# EAGLE design PSX-PS2 (EAGLE 9.6.2)
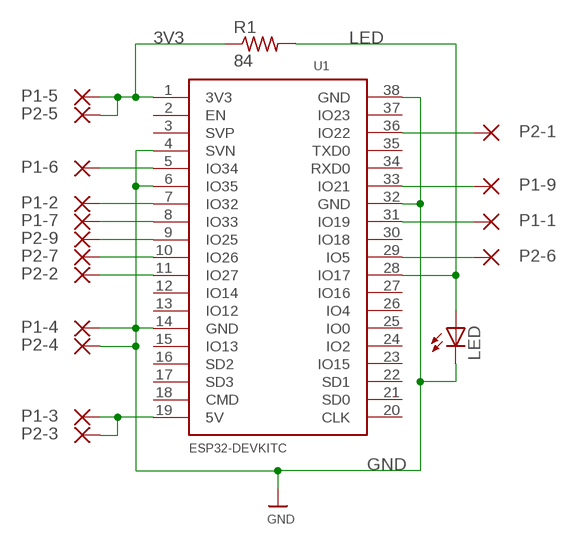
[diagram p0: schematic, sheet 1]

## Parts
LED  LEDCHIPLED_1206  [CHIPLED_1206]
P1-1  SMD5  [SMD2,54-5,08]
P1-2  SMD5  [SMD2,54-5,08]
P1-3  SMD5  [SMD2,54-5,08]
P1-4  SMD5  [SMD2,54-5,08]
P1-5  SMD5  [SMD2,54-5,08]
P1-6  SMD5  [SMD2,54-5,08]
P1-7  SMD5  [SMD2,54-5,08]
P1-9  SMD5  [SMD2,54-5,08]
P2-1  SMD5  [SMD2,54-5,08]
P2-2  SMD5  [SMD2,54-5,08]
P2-3  SMD5  [SMD2,54-5,08]
P2-4  SMD5  [SMD2,54-5,08]
P2-5  SMD5  [SMD2,54-5,08]
P2-6  SMD5  [SMD2,54-5,08]
P2-7  SMD5  [SMD2,54-5,08]
P2-9  SMD5  [SMD2,54-5,08]
R1  84  R-US_R1206  [R1206]
U1  ESP32DEVKITC  [ESP32-DEVKITC]

## Nets
3V3: P1-5.1(P) P2-5.1(P) R1.1 U1.1(3V3)
8V: P1-3.1(P) P2-3.1(P) U1.19(5V)
GND: LED.C P1-4.1(P) P2-4.1(P) U1.4(SVN) U1.6(IO35) U1.14(GND) U1.32(GND) U1.38(GND)
LED: LED.A R1.2 U1.28(IO17)
P1-1: P1-1.1(P) U1.31(IO19)
P1-2: P1-2.1(P) U1.7(IO32)
P1-6: P1-6.1(P) U1.5(IO34)
P1-7: P1-7.1(P) U1.8(IO33)
P1-9: P1-9.1(P) U1.33(IO21)
P2-1: P2-1.1(P) U1.36(IO22)
P2-2: P2-2.1(P) U1.11(IO27)
P2-6: P2-6.1(P) U1.29(IO5)
P2-7: P2-7.1(P) U1.10(IO26)
P2-9: P2-9.1(P) U1.9(IO25)
Unconnected: U1.2(EN) U1.3(SVP) U1.12(IO14) U1.13(IO12) U1.15(IO13) U1.16(SD2) U1.17(SD3) U1.18(CMD) U1.20(CLK) U1.21(SD0) U1.22(SD1) U1.23(IO15) U1.24(IO2) U1.25(IO0) U1.26(IO4) U1.27(IO16) U1.30(IO18) U1.34(RXD0) U1.35(TXD0) U1.37(IO23)

## Library data of the parts
LED = adafruit:LED: LED OSRAM: - CHIPLED LG R971, LG N971, LY N971, LG Q971, LY Q971, LO R971, LY R971 LH N974, LH R974 LS Q976, LO Q976, LY Q976 LO Q996 - Hyper CHIPLED LW Q18S LB Q993, LB Q99A, LB R99A - SideLED LS A670, LO A670, LY A670, LG A670, LP A670 LB A673, LV A673, LT A673, LW A673 LH A674 LY A675 LS A676, LA A676, LO A676, LY A676, LW A676 LS A679, LY A679, LG A679 - Hyper Micro SIDELED® LS Y876, LA Y876, LO Y876, LY Y876 LT Y87S - SmartLED LW L88C, LW L88S LB L89C, LB L89S, LG L890 LS L89K, LO L89K, LY L89K LS L896, LA L896, LO L896, LY L896 - TOPLED LS T670, LO T670, LY T670, LG T670, LP T670 LSG T670, LSP T670, LSY T670, LOP T670, LYG T670 LG T671, LOG T671, LSG T671 LB T673, LV T673, LT T673, LW T673 LH T674 LS T676, LA T676, LO T676, LY T676, LB T676, LH T676, LSB T676, LW T676 LB T67C, LV T67C, LT T67C, LS T67K, LO T67K, LY T67K, LW E67C LS E67B, LA E67B, LO E67B, LY E67B, LB E67C, LV E67C, LT E67C LW T67C LS T679, LY T679, LG T679 LS T770, LO T770, LY T770, LG T770, LP T770 LB T773, LV T773, LT T773, LW T773 LH T774 LS E675, LA E675, LY E675, LS T675 LS T776, LA T776, LO T776, LY T776, LB T776 LHGB T686 LT T68C, LB T68C - Hyper Mini TOPLED® LB M676 - Mini TOPLED Santana® LG M470 LS M47K, LO M47K, LY M47K Source: http://www.osram.convergy.de/
P1-1-P1-7 P1-9 P2-1-P2-7 P2-9 = wirepad:SMD5: SMD PAD
R1 = adafruit:R-US_: RESISTOR, American symbol
U1 = ESP32-DEVKITC4:ESP32DEVKITC

## Board
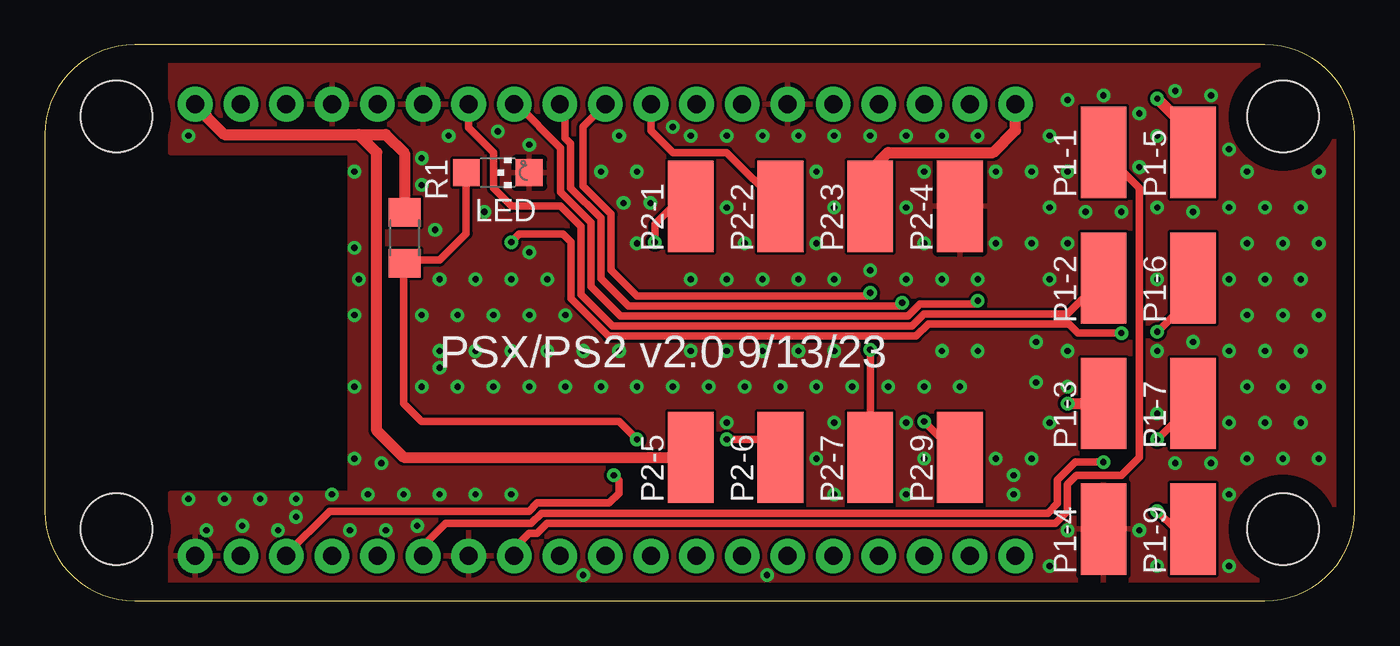
[diagram p1: board, top side]
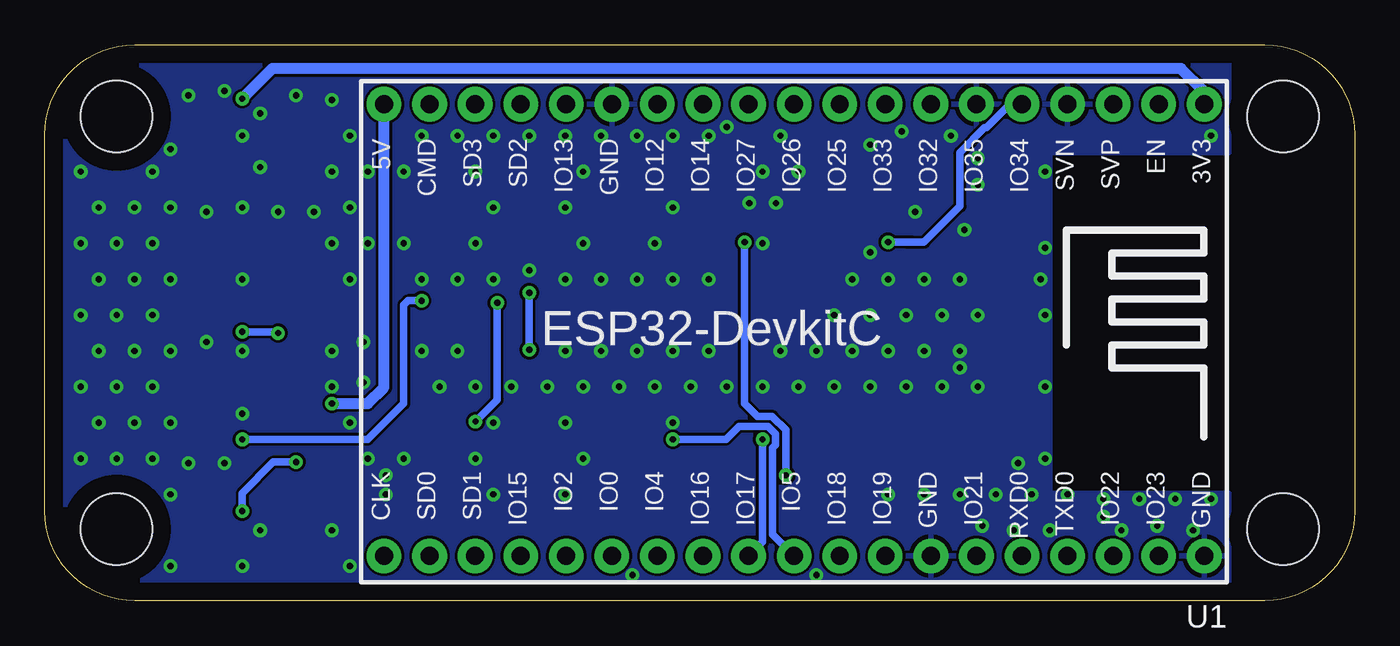
[diagram p2: board, bottom side, seen from below]

Size 73 x 31 mm. Coordinates in mm from the lower left corner, seen from the top.
Outline: 0,26 0,5 arc90 5,0 68,0 arc90 73,5 73,26 arc90 68,31 5,31 arc90 0,26
Copper layers (1*16): Top 0.035mm / dielectric 1.5mm / Bottom 0.035mm
Design rules "default": minimum track width 6mil, minimum drill 0.35mm, track to track 6mil, track to pad 6mil, pad to pad 6mil, via to via 6mil, smd to smd 6mil, copper to edge 40mil, drill to drill 6mil, minimum pad ring 10mil, minimum via ring 8mil, stop-mask expansion 4mil, vias tented up to drill 0.5mm, thermal gap 10mil
Holes 4 mm at 4,4 4,27 69,27 69,4

### Footprints (pad centres in the part's own frame; a part is rotated, then mirrored left to right if it is on the bottom)
CHIPLED_1206 = smd 1.5 x 1.5: A 0,-1.75; C 0,1.75
SMD2,54-5,08 = smd 2.54 x 5.08: 1 0,0
R1206 = smd 1.6 x 1.803: 1 -1.422,0; 2 1.422,0
ESP32-DEVKITC = drill 1 pad 1.93: 1 -22.87,-12.69; 2 -20.33,-12.69; 3 -17.79,-12.69; 4 -15.25,-12.69; 5 -12.71,-12.69; 6 -10.17,-12.69; 7 -7.63,-12.69; 8 -5.09,-12.69; 9 -2.55,-12.69; 10 -0.01,-12.69; 11 2.53,-12.69; 12 5.07,-12.69; 13 7.61,-12.69; 14 10.15,-12.69; 15 12.69,-12.69; 16 15.23,-12.69; 17 17.77,-12.69; 18 20.31,-12.69; 19 22.85,-12.69; 20 22.85,12.5; 21 20.31,12.5; 22 17.77,12.5; 23 15.23,12.5; 24 12.69,12.5; 25 10.15,12.5; 26 7.61,12.5; 27 5.07,12.5; 28 2.53,12.5; 29 -0.01,12.5; 30 -2.55,12.5; 31 -5.09,12.5; 32 -7.63,12.5; 33 -10.17,12.5; 34 -12.71,12.5; 35 -15.25,12.5; 36 -17.79,12.5; 37 -20.33,12.5; 38 -22.87,12.5

### Placement (x,y rotation side)
LED  25.24,23.87 270 top
P1-1  59,25 0 top
P1-2  59,18 0 top
P1-3  59,11 0 top
P1-4  59,4 0 top
P1-5  64,25 0 top
P1-6  64,18 0 top
P1-7  64,11 0 top
P1-9  64,4 0 top
P2-1  36,22 0 top
P2-2  41,22 0 top
P2-3  46,22 0 top
P2-4  51,22 0 top
P2-5  36,8 0 top
P2-6  41,8 0 top
P2-7  46,8 0 top
P2-9  51,8 0 top
R1  20.05,20.24 270 top
U1  31.25,15 180 bottom

### Tracks (layer width: path | path; a pad name or v marks a point on that pad's centre or on a via)
3V3  (via drill 0.35)
  Top 0.61: R1.1 20.05,24.95 19,26 17.5,26 | 17.5,26 10,26 9,27 9,27.07 U1.1 | P2-5.1 20,8 18.5,9.5 18.5,25 17.5,26 | v62,28 64,26 P1-5.1
  Bottom 0.61: U1.1 8.38,28.38 9.68,29.68 60.32,29.68 v62,28
8V  (via drill 0.35)
  Top 0.61: P2-3.1 46,24 47,25 52.86,25 54.1,26.24 U1.19 | v57,11 P1-3.1
  Bottom 0.61: v57,11 55,11 54.1,11.9 U1.19
GND  (via drill 0.35)
  other vias: 22,13 54,7 9,3.93 8,5.68 8,25.93 11,4.18 10,5.68 14,4.68 13,3.93 12,5.68 14,5.68 17,3.93 16,5.93 17.25,7.93 17.25,11.93 17.25,15.93 17.25,19.68 17.25,23.93 19,3.93 18,5.93 18.75,7.68 17.5,17.93 20.75,4.18 20,5.93 21,11.93 21,15.93 21,23.18 21,24.68 22,5.93 23,11.93 22,13.93 23,15.93 22,17.93 21.75,20.68 22.5,25.93 24,5.93 25,11.93 24,13.93 25,15.93 24,17.93 24.5,21.68 26,5.93 27,11.93 26,13.93 27,15.93 26,17.93 27,19.43 27,25.43 25.25,26.18 29,11.93 28,13.93 29,15.93 28,17.93 30,1.43 31,11.93 30,13.93 31,23.93 33,11.93 32,13.93 33,19.93 32.25,22.18 33,23.93 32,25.93 35,11.93 33.75,22.18 35,26.43 37,11.93 36,13.93 36,17.93 36,25.93 38,9.93 39,11.93 38,13.93 38,17.93 39,19.93 38,21.93 38,25.93 40.25,1.43 41,11.93 40,13.93 40,17.93 40,25.93 43,7.93 43,11.93 42,13.93 42,17.93 43,19.93 43,23.93 42,25.93 44,5.93 44,9.93 45,11.93 44,13.93 44,17.93 44,21.93 44,25.93 47,11.93 46,18.43 46,25.93 48,5.93 49,7.93 48,9.93 49,11.93 48,17.93 49,19.93 48,21.93 49,23.93 48,25.93 51,11.93 50,13.93 50,17.93 50,25.93 53,7.93 52,13.93 52,17.93 53,19.93 53,23.93 52,25.93 54,5.93 55,7.93 55.25,12.18 55,19.93 55,23.93 56,1.93 57,3.93 56,9.93 57,11.93 55.25,14.43 56,17.93 57,19.93 56,21.93 57,23.93 56,25.93 57,27.93 57,13.93 58,21.68 59,28.18 61,3.93 60,21.68 61,24.18 61,27.18 62,1.93 63,7.68 62,10.43 62,13.93 62,17.93 62,21.93 62,25.93 63,28.43 65,7.68 64,14.43 64,21.68 65,28.18 66,1.93 66,5.93 67,7.93 66,9.93 67,11.93 66,13.93 67,15.93 66,17.93 67,19.93 66,21.93 67,23.93 66,25.18 69,7.93 68,9.93 69,11.93 68,13.93 69,15.93 68,17.93 69,19.93 68,21.93 71,7.93 70,9.93 71,11.93 70,13.93 71,15.93 70,17.93 71,19.93 70,21.93 71,23.93
  pour Top: 7,31 7,25 17,25 17,6 7,6 7,0 73,0 73,31
  pour Bottom: 7,0 73,0 73,31 7,31 7,25 17,25 17,6 7,6
LED  (via drill 0.35)
  Top 0.406: v33,9 32,10 21,10 20,11 20,18.77 R1.2 20.23,19 22,19 23.49,20.49 LED.A
  Bottom 0.406: U1.28 33,3.28 v33,9
P1-1
  Top 0.406: P1-1.1 61,23 61,8 60,7 57.5,7 57,6.5 57,5 56.33,4.33 28,4.33 27.44,3.77 27,3.77 26.16,2.93 U1.31
P1-2
  Top 0.406: P1-2.1 57,16 49,16 48.32,15.32 31.64,15.32 29.88,17.08 29.88,20.87 28.75,22 26,22 25,23 25,25 23.62,26.38 U1.7
P1-6  (via drill 0.35)
  Top 0.406: v26,20 26.44,20.44 28.88,20.44 29.32,20 29.32,16.85 31.41,14.77 48.55,14.77 49.23,15.44 57.06,15.44 57.57,14.93 v60,14.93 | v62,15 64,17 P1-6.1
  Bottom 0.406: v26,20 25,20 24.62,20 24,20 22,22 22,25 20.63,26.37 20.53,26.37 19.21,27.69 U1.5 | v60,14.93 60.07,15 v62,15
P1-7  (via drill 0.35)
  Top 0.406: v62,9 P1-7.1 | v52,16.73 51.83,16.56 48.77,16.56 48.09,15.88 32.08,15.88 30.44,17.52 30.44,21.1 28.75,22.79 28.75,25.25 26.31,27.69 U1.8
  Bottom 0.406: v52,16.73 52.77,16.73 53,16.5 53,11 55,9 v62,9
P1-9  (via drill 0.35)
  Top 0.406: P1-9.1 63,4 v62,5 | v59,7.73 57.44,7.73 56.44,6.73 56.44,5.44 55.89,4.89 27.67,4.89 27.11,4.33 22.33,4.33 21.08,3.08 U1.33
  Bottom 0.406: v59,7.73 60.27,7.73 62,6 v62,5
P2-1  (via drill 0.35)
  Top 0.406: v34,20 34,21 35,22 P2-1.1 | v31.71,7 32,6.71 32,6 31.45,5.45 27.44,5.45 26.99,5 15.87,5 13.46,2.59 U1.36
  Bottom 0.406: v31.71,7 31.71,9.54 32.47,10.29 33.29,10.29 34,11 v34,20
P2-2
  Top 0.406: P2-2.1 38,25 35,25 33.78,26.22 U1.11
P2-6  (via drill 0.35)
  Top 0.406: v38,9 40,9 P2-6.1
  Bottom 0.406: v38,9 35.04,9 34.3,9.73 32.7,9.73 32.27,9.3 32.27,8.7 32.44,8.52 32.44,3.7 U1.29
P2-7  (via drill 0.35)
  Top 0.406: P2-7.1 v46,14 | v46,17.18 45.83,17 33,17 31.56,18.44 31.56,21.56 30,23.12 30,26.45 U1.10
  Bottom 0.406: v46,14 v46,17.18
P2-9  (via drill 0.35)
  Top 0.406: v49,10 P2-9.1 | v47.79,16.62 47.61,16.44 32.52,16.44 31,17.96 31,21.33 29.31,23.02 29.31,25.48 29,25.79 29,27.39 U1.9
  Bottom 0.406: v49,10 47.79,11.21 v47.79,16.62

### Text on the board
tPlace: PSX/PS2 v2.0 9/13/23